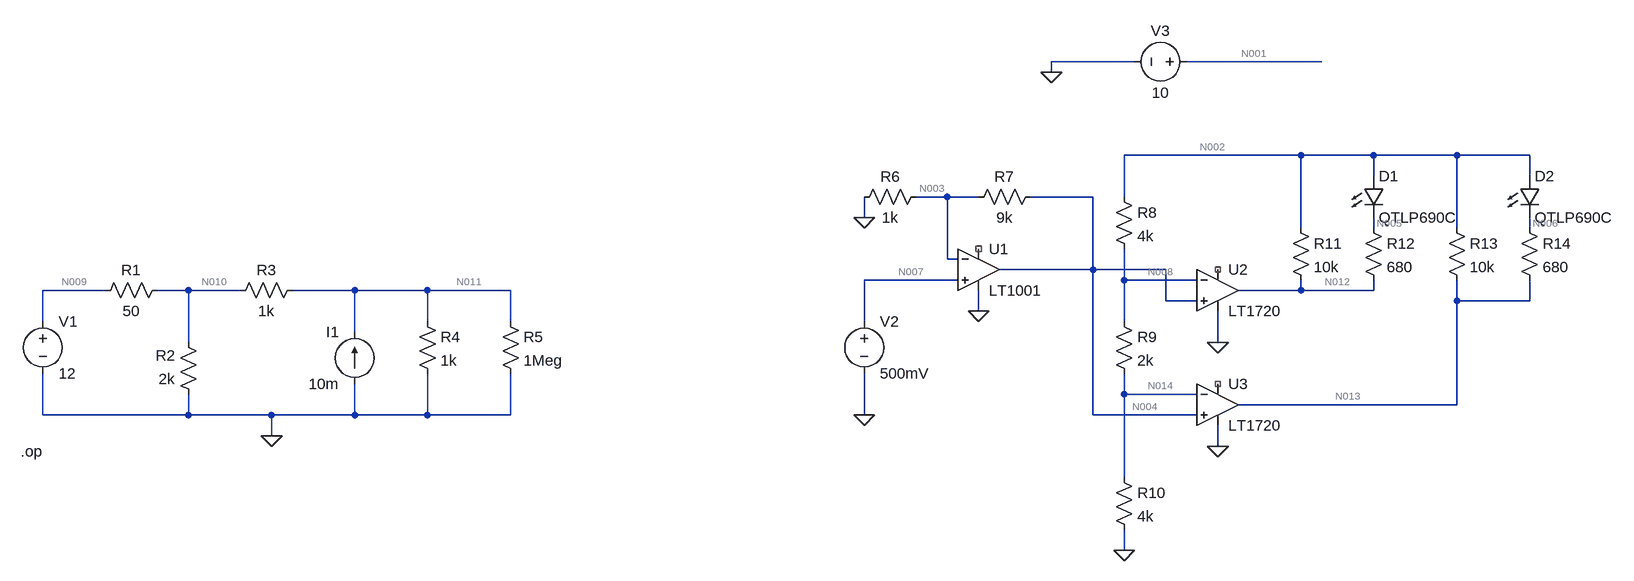
[diagram p0: schematic Formatif pratique.asc]
Formatif pratique.asc, the LTspice schematic file:
Version 4
SHEET 1 2600 680
WIRE 1696 -224 1568 -224
WIRE 1984 -224 1776 -224
WIRE 1568 -208 1568 -224
WIRE 1952 -80 1680 -80
WIRE 2064 -80 1952 -80
WIRE 2192 -80 2064 -80
WIRE 2304 -80 2192 -80
WIRE 2064 -48 2064 -80
WIRE 2304 -48 2304 -80
WIRE 1408 -16 1360 -16
WIRE 1456 -16 1408 -16
WIRE 1632 -16 1536 -16
WIRE 1680 -16 1680 -80
WIRE 1280 16 1280 -16
WIRE 1952 32 1952 -80
WIRE 2064 32 2064 16
WIRE 2192 32 2192 -80
WIRE 2304 32 2304 16
WIRE 1408 80 1408 -16
WIRE 1424 80 1408 80
WIRE 1632 96 1632 -16
WIRE 1632 96 1488 96
WIRE 1744 96 1632 96
WIRE 1424 112 1280 112
WIRE 1680 112 1680 64
WIRE 1792 112 1680 112
WIRE 112 128 16 128
WIRE 240 128 192 128
WIRE 320 128 240 128
WIRE 496 128 400 128
WIRE 608 128 496 128
WIRE 736 128 608 128
WIRE 1952 128 1952 112
WIRE 1952 128 1856 128
WIRE 2064 128 2064 112
WIRE 2064 128 1952 128
WIRE 1744 144 1744 96
WIRE 1792 144 1744 144
WIRE 2192 144 2192 112
WIRE 2304 144 2304 112
WIRE 2304 144 2192 144
WIRE 1456 160 1456 128
WIRE 16 176 16 128
WIRE 608 176 608 128
WIRE 736 176 736 128
WIRE 1280 176 1280 112
WIRE 1680 176 1680 112
WIRE 496 192 496 128
WIRE 240 208 240 128
WIRE 1824 208 1824 160
WIRE 1680 288 1680 256
WIRE 1792 288 1680 288
WIRE 2192 304 2192 144
WIRE 2192 304 1856 304
WIRE 16 320 16 256
WIRE 240 320 240 288
WIRE 240 320 16 320
WIRE 368 320 240 320
WIRE 496 320 496 272
WIRE 496 320 368 320
WIRE 608 320 608 256
WIRE 608 320 496 320
WIRE 736 320 736 256
WIRE 736 320 608 320
WIRE 1280 320 1280 256
WIRE 1632 320 1632 96
WIRE 1792 320 1632 320
WIRE 368 352 368 320
WIRE 1824 368 1824 336
WIRE 1680 416 1680 288
WIRE 1680 528 1680 496
FLAG 368 352 0
FLAG 1280 320 0
FLAG 1280 16 0
FLAG 1824 208 0
FLAG 1824 368 0
FLAG 1680 528 0
FLAG 1456 160 0
FLAG 1568 -208 0
DATAFLAG 240 288 ""
DATAFLAG 240 160 ""
DATAFLAG 304 480 "I(R2)"
DATAFLAG 16 160 "I(V1)"
DATAFLAG 16 288 ""
DATAFLAG 496 176 ""
DATAFLAG 496 288 ""
SYMBOL res 208 112 R90
WINDOW 0 0 56 VBottom 2
WINDOW 3 32 56 VTop 2
SYMATTR InstName R1
SYMATTR Value 50
SYMBOL res 256 304 R180
WINDOW 0 36 76 Left 2
WINDOW 3 36 40 Left 2
SYMATTR InstName R2
SYMATTR Value 2k
SYMBOL res 304 144 R270
WINDOW 0 32 56 VTop 2
WINDOW 3 0 56 VBottom 2
SYMATTR InstName R3
SYMATTR Value 1k
SYMBOL res 592 160 R0
SYMATTR InstName R4
SYMATTR Value 1k
SYMBOL res 720 160 R0
SYMATTR InstName R5
SYMATTR Value 1Meg
SYMBOL voltage 16 160 R0
WINDOW 123 0 0 Left 0
WINDOW 39 0 0 Left 0
SYMATTR InstName V1
SYMATTR Value 12
SYMBOL current 496 272 R180
WINDOW 0 24 80 Left 2
WINDOW 3 24 0 Left 2
WINDOW 123 0 0 Left 0
WINDOW 39 0 0 Left 0
SYMATTR InstName I1
SYMATTR Value 10m
SYMBOL voltage 1280 160 R0
WINDOW 123 0 0 Left 0
WINDOW 39 0 0 Left 0
SYMATTR InstName V2
SYMATTR Value 500mV
SYMBOL Comparators\\LT1720 1824 64 R0
SYMATTR InstName U2
SYMBOL Comparators\\LT1720 1824 240 R0
SYMATTR InstName U3
SYMBOL res 1376 -32 R90
WINDOW 0 0 56 VBottom 2
WINDOW 3 32 56 VTop 2
SYMATTR InstName R6
SYMATTR Value 1k
SYMBOL res 1552 -32 R90
WINDOW 0 0 56 VBottom 2
WINDOW 3 32 56 VTop 2
SYMATTR InstName R7
SYMATTR Value 9k
SYMBOL res 1664 -32 R0
SYMATTR InstName R8
SYMATTR Value 4k
SYMBOL res 1664 160 R0
SYMATTR InstName R9
SYMATTR Value 2k
SYMBOL res 1664 400 R0
SYMATTR InstName R10
SYMATTR Value 4k
SYMBOL res 1936 16 R0
SYMATTR InstName R11
SYMATTR Value 10k
SYMBOL res 2048 16 R0
SYMATTR InstName R12
SYMATTR Value 680
SYMBOL res 2176 16 R0
SYMATTR InstName R13
SYMATTR Value 10k
SYMBOL res 2288 16 R0
SYMATTR InstName R14
SYMATTR Value 680
SYMBOL LED 2048 -48 R0
SYMATTR InstName D1
SYMATTR Value QTLP690C
SYMBOL LED 2288 -48 R0
SYMATTR InstName D2
SYMATTR Value QTLP690C
SYMBOL voltage 1792 -224 R90
WINDOW 0 -32 56 VBottom 2
WINDOW 3 32 56 VTop 2
WINDOW 123 0 0 Left 0
WINDOW 39 0 0 Left 0
SYMATTR InstName V3
SYMATTR Value 10
SYMBOL OpAmps\\LT1001 1456 32 R0
SYMATTR InstName U1
TEXT -18 376 Left 2 !.op

The netlist it stands for:
* Formatif pratique.asc
R1 N010 N009 50
R2 0 N010 2k
R3 N010 N011 1k
R4 N011 0 1k
R5 N011 0 1Meg
V1 N009 0 12
I1 0 N011 10m
V2 N007 0 500mV
XU2 N004 N008 NC_01 0 N012 LT1720  ; pins In+ In- V+ V- OUT
XU3 N004 N014 NC_02 0 N013 LT1720  ; pins In+ In- V+ V- OUT
R6 N003 0 1k
R7 N004 N003 9k
R8 N002 N008 4k
R9 N008 N014 2k
R10 N014 0 4k
R11 N002 N012 10k
R12 N005 N012 680
R13 N002 N013 10k
R14 N006 N013 680
D1 N002 N005 QTLP690C
D2 N002 N006 QTLP690C
V3 N001 0 10
XU1 N007 N003 NC_03 0 N004 LT1001  ; pins In+ In- V+ V- OUT
.model D D
.lib standard.dio
.op
.lib LT1720.sub
.lib LTC.lib
.backanno
.end

* Results of the author's LTspice run, read from the files saved beside the schematic
* Operating Point:
*   V(n010) = 11.67 V
*   V(n009) = 12 V
*   V(n011) = 10.83 V
*   V(n007) = 500 mV
*   V(n008) = -56.11 mV
*   V(n004) = -27.38 mV
*   V(n012) = -163.8 mV
*   V(n014) = -36.27 mV
*   V(n013) = -163.8 mV
*   V(n003) = -2.732 mV
*   V(n002) = -104 mV
*   V(n005) = -163.8 mV
*   V(n006) = -163.8 mV
*   V(n001) = 10 V
*   I(D2) = 59.82 fA
*   I(D1) = 59.82 fA
*   I(I1) = 10 mA
*   I(R14) = 59.82 fA
*   I(R13) = 5.982 µA
*   I(R12) = 59.82 fA
*   I(R11) = 5.982 µA
*   I(R10) = -9.067 µA
*   I(R9) = -9.92 µA
*   I(R8) = -11.96 µA
*   I(R7) = -2.738 µA
*   I(R6) = -2.732 µA
*   I(R5) = 10.83 µA
*   I(R4) = 10.83 mA
*   I(R3) = 838.6 µA
*   I(R2) = -5.833 mA
*   I(R1) = -6.672 mA
*   I(V3) = 0 A
*   I(V2) = -6.788 nA
*   I(V1) = -6.672 mA
*   Ix(u2:1) = 2.043 µA
*   Ix(u2:2) = -2.043 µA
*   Ix(u2:3) = 0 A
*   Ix(u2:4) = -5.982 µA
*   Ix(u2:5) = 5.982 µA
*   Ix(u3:1) = 852.7 nA
*   Ix(u3:2) = -852.7 nA
*   Ix(u3:3) = 0 A
*   Ix(u3:4) = -5.982 µA
*   Ix(u3:5) = 5.982 µA
*   Ix(u1:1) = 6.788 nA
*   Ix(u1:2) = -6.787 nA
*   Ix(u1:3) = 0 A
*   Ix(u1:4) = -81.44 pA
*   Ix(u1:5) = -157.7 nA
* From the log:
*   Semiconductor Device Operating Points:
*                           --- Diodes ---
*   Name:    d:u1:4      d:u1:1        d2          d1        d:u3:9
*   Model:    u1:di       u1:x      qtlp690c    qtlp690c   u3:dilimu2
*   Id:     -5.03e-10   -1.58e-07    5.98e-14    5.98e-14    1.76e-06
*   Vd:     -5.03e-01   -8.38e-01    5.98e-02    5.98e-02    1.76e-01
*   Req:     1.00e-09    1.00e-04    1.00e+12    1.00e+12    1.00e-05
*   CAP:     0.00e+00    0.00e+00    5.16e-11    5.16e-11    0.00e+00
*   Name:    d:u3:6      d:u3:4      d:u3:2      d:u3:15     d:u3:1
*   Model:  u3:dbiasc   u3:dbias    u3:dbias    u3:dsionp  u3:dsioffp
*   Id:      8.53e-07    3.98e-12    4.86e-12    1.17e-07   -1.03e-10
*   Vd:      8.89e-03    3.98e-02    4.86e-02    2.75e+00   -2.75e+00
*   Req:     1.00e-04    1.00e-10    1.00e-10    4.44e+05    1.00e+12
*   CAP:     0.00e+00    0.00e+00    0.00e+00    2.25e-16    1.00e-21
*   Name:    d:u3:7      d:u3:3      d:u3:16     d:u3:8      d:u3:13
*   Model: u3:dsioffn   u3:dsionn   u3:dilimd  u3:dilimu1     u3:dp
*   Id:      1.42e-07   -1.88e-13   -3.36e-07   -8.08e-06    1.24e-08
*   Vd:      1.88e-01   -1.88e-01    1.69e-01    1.76e-01    1.24e-02
*   Req:     1.83e+05    1.00e+12    1.43e-01    6.67e-02    1.00e-06
*   CAP:     5.48e-16    2.00e-22    0.00e+00    0.00e+00    0.00e+00
*   Name:    d:u3:5      d:u2:9      d:u2:6      d:u2:4      d:u2:2
*   Model:   u3:dlat   u2:dilimu2   u2:dbiasc   u2:dbias    u2:dbias
*   Id:     -9.84e-05    1.76e-06    2.04e-06    3.98e-12    6.85e-12
*   Vd:     -9.84e-01    1.76e-01    2.87e-02    3.98e-02    6.85e-02
*   Req:     1.00e-04    1.00e-05    1.00e-04    1.00e-10    1.00e-10
*   CAP:     0.00e+00    0.00e+00    0.00e+00    0.00e+00    0.00e+00
*   Name:    d:u2:15     d:u2:1      d:u2:7      d:u2:3      d:u2:16
*   Model:  u2:dsionp  u2:dsioffp  u2:dsioffn   u2:dsionn   u2:dilimd
*   Id:      1.17e-07   -1.03e-10    1.42e-07   -1.88e-13   -3.36e-07
*   Vd:      2.75e+00   -2.75e+00    1.88e-01   -1.88e-01    1.69e-01
*   Req:     4.44e+05    1.00e+12    1.83e+05    1.00e+12    1.43e-01
*   CAP:     2.25e-16    1.00e-21    5.48e-16    2.00e-22    0.00e+00
*   Name:    d:u2:8      d:u2:13     d:u2:5
*   Model: u2:dilimu1     u2:dp      u2:dlat
*   Id:     -8.08e-06    1.24e-08   -9.84e-05
*   Vd:      1.76e-01    1.24e-02   -9.84e-01
*   Req:     6.67e-02    1.00e-06    1.00e-04
*   CAP:     0.00e+00    0.00e+00    0.00e+00
*                           --- VDMOSFET Transistors ---
*   Name:        m:u1:2      m:u1:1      m:u3:4      m:u3:3      m:u2:4
*   Model:        u1:p        u1:n        u3:pi       u3:ni       u2:pi
*   Id:          4.62e-14    8.43e-11    6.32e-06   -3.36e-07    6.32e-06
*   Vgs:         9.32e-01    9.32e-01   -2.57e+00   -3.56e-01   -2.57e+00
*   Vds:         2.74e-02    1.37e-09    8.52e-06   -3.33e-01    8.52e-06
*   Vth:         3.00e-01   -3.00e-01   -1.00e-01    1.00e-01   -1.00e-01
*   Gm:          0.00e+00    6.84e-11    2.56e-06    0.00e+00    2.56e-06
*   Gds:         0.00e+00    6.16e-02    7.41e-01    0.00e+00    7.41e-01
*   Cgs:         0.00e+00    0.00e+00    0.00e+00    0.00e+00    0.00e+00
*   Cgd:         0.00e+00    0.00e+00    0.00e+00    0.00e+00    0.00e+00
*   Cbody:       0.00e+00    0.00e+00    0.00e+00    0.00e+00    0.00e+00
*   Name:        m:u2:3
*   Model:        u2:ni
*   Id:         -3.36e-07
*   Vgs:        -3.56e-01
*   Vds:        -3.33e-01
*   Vth:         1.00e-01
*   Gm:          0.00e+00
*   Gds:         0.00e+00
*   Cgs:         0.00e+00
*   Cgd:         0.00e+00
*   Cbody:       0.00e+00